# Altium schematic sheet Relay_Logic.SchDoc
size A
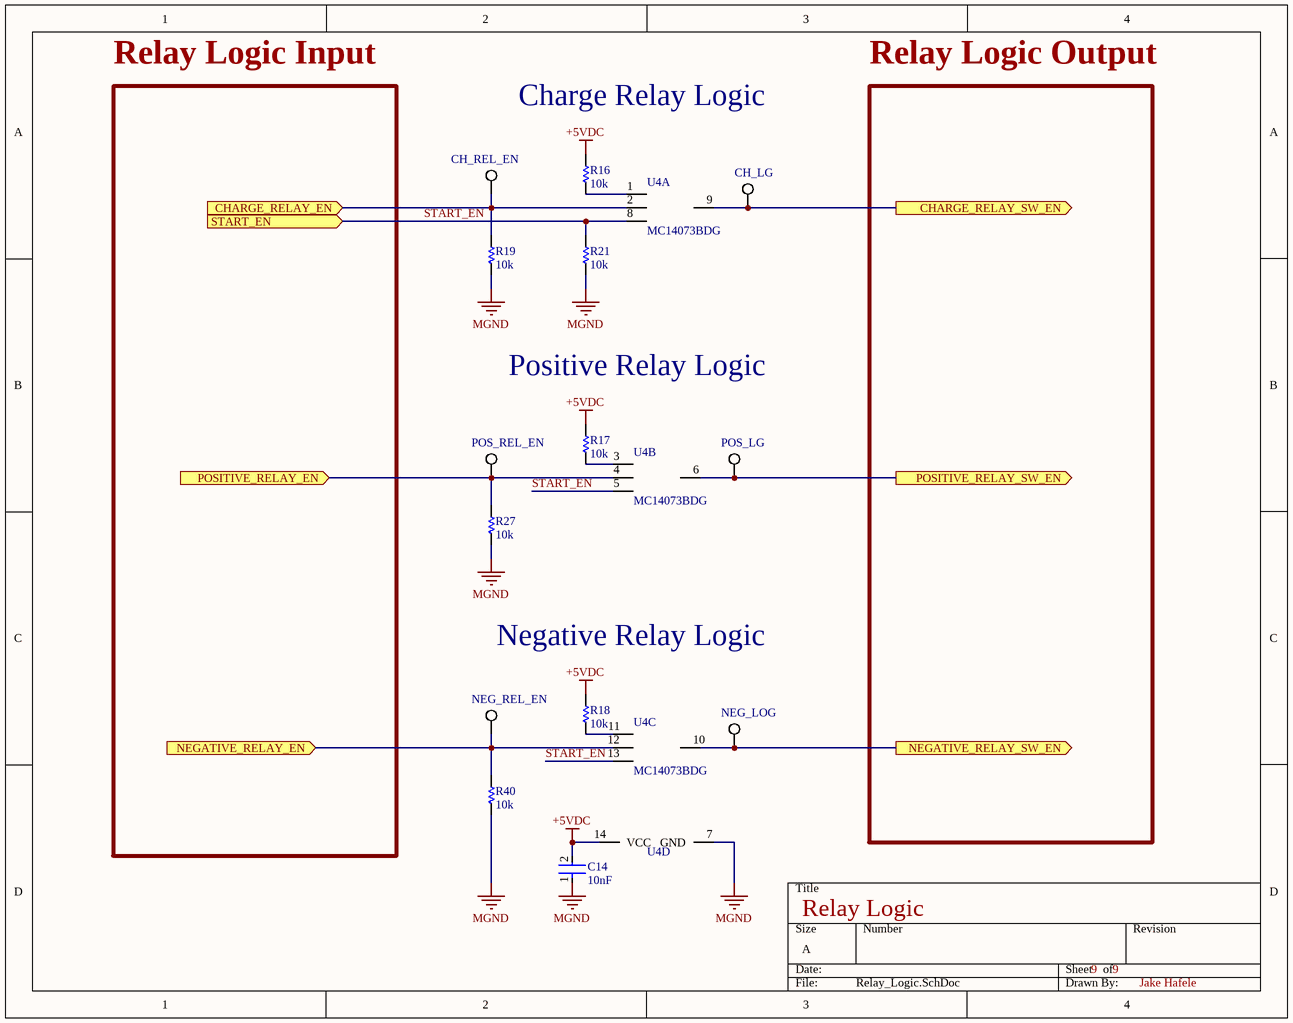
[diagram p0: Relay_Logic.SchDoc]

## Parts
C14  Capacitance: 10nF  [FP-CGA3E-0_3-0_1-IPC_A]  (hidden comment: CGA3E2X8R2A103K080AD)
CH_LG  Test Point  [Test Point]  (value not drawn)
CH_REL_EN  Test Point  [Test Point]  (value not drawn)
NEG_LOG  Test Point  [Test Point]  (value not drawn)
NEG_REL_EN  Test Point  [Test Point]  (value not drawn)
POS_LG  Test Point  [Test Point]  (value not drawn)
POS_REL_EN  Test Point  [Test Point]  (value not drawn)
R16  SchematicInformation: 10k  [R_0603]  (hidden comment: RES_10k_1%_0603)
R17  SchematicInformation: 10k  [R_0603]  (hidden comment: RES_10k_1%_0603)
R18  SchematicInformation: 10k  [R_0603]  (hidden comment: RES_10k_1%_0603)
R19  SchematicInformation: 10k  [R_0603]  (hidden comment: RES_10k_1%_0603)
R21  SchematicInformation: 10k  [R_0603]  (hidden comment: RES_10k_1%_0603)
R27  SchematicInformation: 10k  [R_0603]  (hidden comment: RES_10k_1%_0603)
R40  SchematicInformation: 10k  [R_0603]  (hidden comment: RES_10k_1%_0603)
U4  MC14073BDG  [SO14]  (parts A,B,C,D of 4)

## Ports
CHARGE_RELAY_EN (in), CHARGE_RELAY_SW_EN (out), NEGATIVE_RELAY_EN (in), NEGATIVE_RELAY_SW_EN (out), POSITIVE_RELAY_EN (in), POSITIVE_RELAY_SW_EN (out), START_EN (in)

## Nets
+5VDC: C14.2 R16.1 R17.1 R18.1 U4.14(VCC)
MGND: C14.1 R19.2 R21.2 R27.2 R40.2 U4.7(GND)
CHARGE_RELAY_EN: CH_REL_EN.1 R19.1 U4.2 ; port CHARGE_RELAY_EN
CHARGE_RELAY_SW_EN: CH_LG.1 U4.9 ; port CHARGE_RELAY_SW_EN
NEGATIVE_RELAY_EN: NEG_REL_EN.1 R40.1 U4.12 ; port NEGATIVE_RELAY_EN
NEGATIVE_RELAY_SW_EN: NEG_LOG.1 U4.10 ; port NEGATIVE_RELAY_SW_EN
POSITIVE_RELAY_EN: POS_REL_EN.1 R27.1 U4.4 ; port POSITIVE_RELAY_EN
POSITIVE_RELAY_SW_EN: POS_LG.1 U4.6 ; port POSITIVE_RELAY_SW_EN
START_EN: R21.1 U4.5 U4.8 U4.13 ; port START_EN
NetR16_2: R16.2 U4.1
NetR17_2: R17.2 U4.3
NetR18_2: R18.2 U4.11

## Notes on the sheet
- Relay Logic Input
- Relay Logic Output
- Charge Relay Logic
- Positive Relay Logic
- Negative Relay Logic
- Relay Logic
- 9
- Jake Hafele

## Library data of the parts
C14 = CMP-08246-000769-1: Cap Ceramic 10nF 100V X8R 10% Pad SMD 0603 +150°C Automotive T/R; Mount: Surface Mount; Voltage Rating (DC): 100V; Termination: SMD/SMT; Dielectric: X8R; Case/Package: 0603; Ratings: AEC-Q200; Voltage Rating: 100V; Packaging: Tape and Reel; Thickness: 0.035inch; Composition: Ceramic; Max Operating Temperature: 150°C; Width: 0.031inch; Height: 0.8mm; Weight: 7.1E-05oz; Depth: 0.8mm; Min Operating Temperature: -55°C; Length: 1.6mm; Case Code (Metric): 1608; Tolerance: 10%; Package Quantity: 4000; Case Code (Imperial): 0603
R16-R19 R21 R27 R40 = RES_10k_1%_0603: Manufacturer Part Number: RC0603FR-0710KL; Manufacturer: Yageo; DigiKey Part Number: 311-10.0KHRCT-ND
U4 = MC14073BDG: Triple 3-Input AND; ComponentLink1Description: Datasheet; ComponentLink1URL: http://www.onsemi.com/pub_link/Collateral/MC14001B-D.PDF; Drawn By: Aaron Mills; Drawing Date: Jan. 17, 2011